# EAGLE schematic Prova01 (EAGLE 6.4)
Circuito per mantenere l'autoradio acceso per ancora 15 minuti dopo aver spento la macchina.
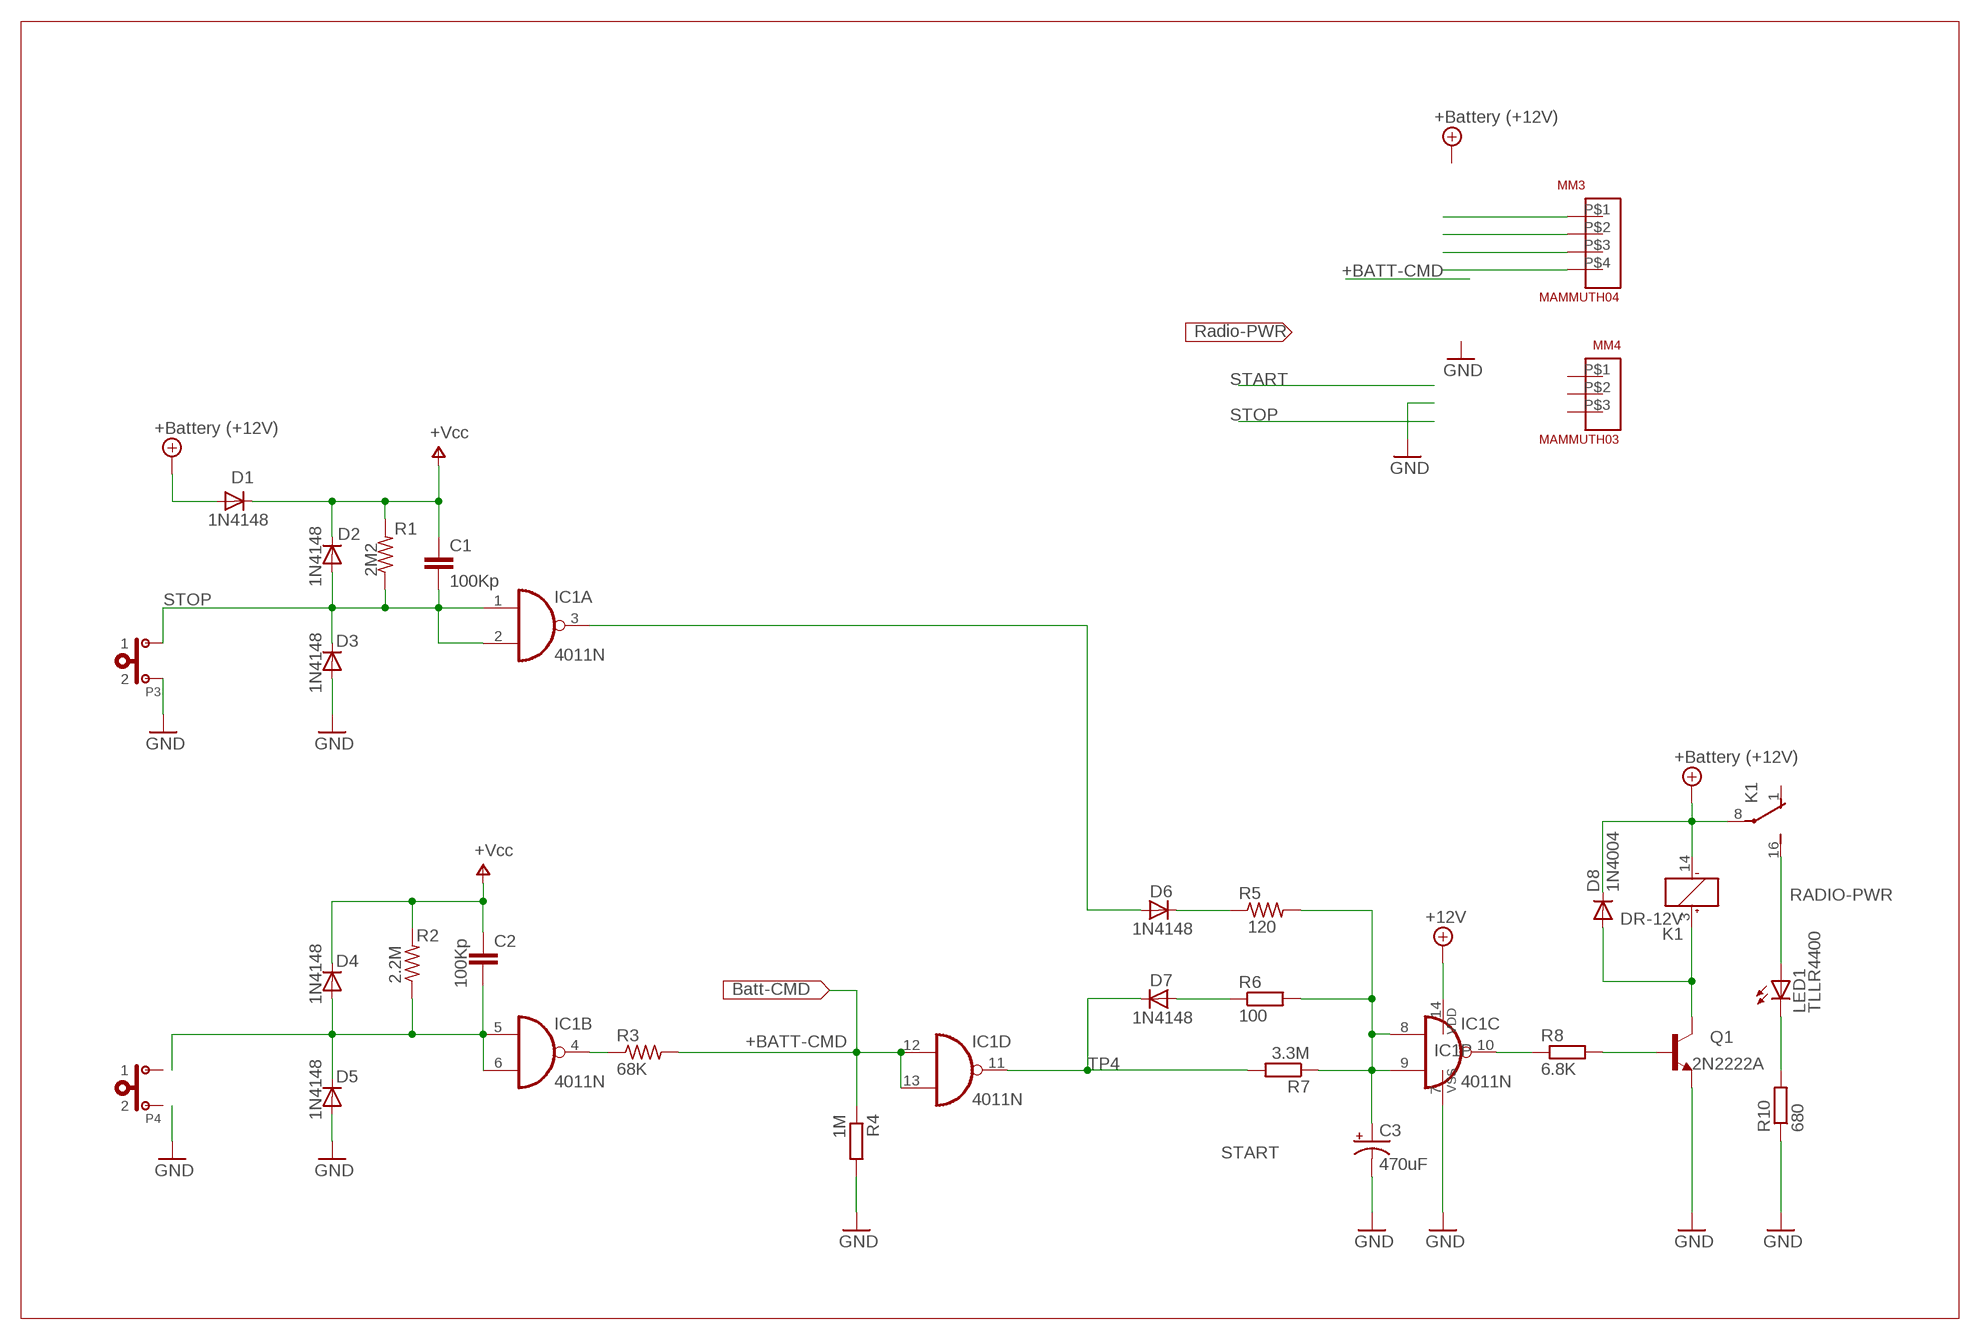
[diagram p0: schematic, sheet 1]

## Parts
C1  100Kp  C-EU025-025X050  [C025-025X050]
C2  100Kp  C-EU025-025X050  [C025-025X050]
C3  470uF  CPOL-USE3.5-8  [E3,5-8]
D1  1N4148  1N4148DO35-10  [DO35-10]
D2  1N4148  1N4148DO35-10  [DO35-10]
D3  1N4148  1N4148DO35-10  [DO35-10]
D4  1N4148  1N4148DO35-10  [DO35-10]
D5  1N4148  1N4148DO35-10  [DO35-10]
D6  1N4148  1N4148DO35-10  [DO35-10]
D7  1N4148  1N4148DO35-10  [DO35-10]
D8  1N4004  [DO41-10]
IC1  4011N  [DIL14]
K1  DR-12V  [DR-1]
LED1  TLLR4400  [LED3MM]
MM3  MAMMUTH04  [MAMMUTH04]
MM4  MAMMUTH03  [MAMMUTH03]
P3  PULSANTENO  [SIP02]
P4  PULSANTENO  [SIP02]
Q1  2N2222A  [TO18]
R1  2M2  R-US_0207/12  [0207/12]
R2  2.2M  R-US_0207/12  [0207/12]
R3  68K  R-US_0207/12  [0207/12]
R4  1M  R-EU_0207/10  [0207/10]
R5  120  R-US_0207/12  [0207/12]
R6  100  R-EU_0207/10  [0207/10]
R7  3.3M  R-EU_0207/10  [0207/10]
R8  6.8K  R-EU_0207/10  [0207/10]
R10  680  R-EU_0207/10  [0207/10]

## Nets
+12V: D1.A D8.C IC1.14(P:VDD) K1.8(-2:P) K1.14(-1:-) ; supply symbol labelled +Battery (+12V)
+BATT-CMD: IC1.12(D:I0) IC1.13(D:I1) R3.2 R4.1
GND: C3.- D3.A D5.A IC1.7(P:VSS) P3.2 Q1.1(E) R4.2 R10.1
N$1: C2.2 D4.A D5.C IC1.5(B:I0) IC1.6(B:I1) R2.1
N$2: Q1.2(B) R8.2
N$3: D8.A K1.3(-1:+) Q1.3(C)
N$4: D6.C R5.1
N$5: IC1.4(B:O) R3.1
N$8: LED1.K(C) R10.2
N$9: D6.A IC1.3(A:O)
RADIO-PWR: K1.16(-2:S) LED1.A
START: D7.A R6.1
STOP: C1.2 D2.A D3.C IC1.1(A:I0) IC1.2(A:I1) P3.1 R1.1
TP4: D7.C IC1.11(D:O) R7.2
TP4A: C3.+ IC1.8(C:I0) IC1.9(C:I1) R5.2 R6.2 R7.1
TP5: IC1.10(C:O) R8.1
V+: C1.1 C2.1 D1.C D2.C D4.C R1.2 R2.2 ; supply symbol labelled +Vcc
Unconnected: K1.1(-2:O) MM3.P$1 MM3.P$2 MM3.P$3 MM3.P$4 MM4.P$1 MM4.P$2 MM4.P$3 P4.1 P4.2

## Library data of the parts
C1 C2 = rcl:C-EU: CAPACITOR, European symbol
C3 = rcl:CPOL-US: POLARIZED CAPACITOR, American symbol
D1-D7 = diode:1N4148: DIODE high speed (Philips)
D8 = diode:1N4004: DIODE general purpose rectifier, 1 A
IC1 = 40xx:4011: Quad 2-input NAND
K1 = relay:DR-*V: HIGHLY RELIABLE MINIATURE DIP RELAYS NAiS Source: www.mew-europe.com/ac/download/ datasheet/relay/dr_en.pdf; MPN: DR-12V; OC_FARNELL: 1124066; OC_NEWARK: 91K6794
LED1 = Loreto:TLLR4400: Low Current (2mA) LED 3 mm Tinted Diffused Package color RED Source: Data sheet <http://www.farnell.com/datasheets/391100.pdf>; MF: VISHAY SEMICONDUCTOR; OC_FARNELL: 1612437
MM3 = Ln-Varie:MAMMUTH04: Mammuth 04
MM4 = Ln-Varie:MAMMUTH03: Mammuth 03
P3 P4 = Ln-Varie:PULSANTENO: Pulsante NO
Q1 = transistor-npn:2N2222*: NPN Transistor
R1-R3 R5 = rcl:R-US_: RESISTOR, American symbol
R4 R6-R8 R10 = rcl:R-EU_: RESISTOR, European symbol